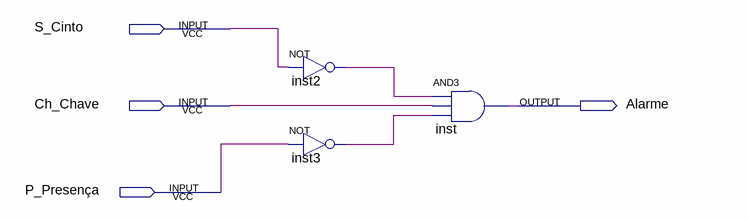
[diagram p0: schematic sheet]
// Quartus schematic questao_01.bdf as structural Verilog: 3 symbols, 4 pins
module questao_01 (
  input  S_Cinto,
  input  Ch_Chave,
  input  \P_Presença ,
  output Alarme
);

  wire inst2_out, inst3_out;

  not inst2 (inst2_out, S_Cinto);
  not inst3 (inst3_out, \P_Presença );
  and inst (Alarme, inst2_out, Ch_Chave, inst3_out);
endmodule
